# EAGLE schematic schemat sterownika Czujników (EAGLE 9.6.2)
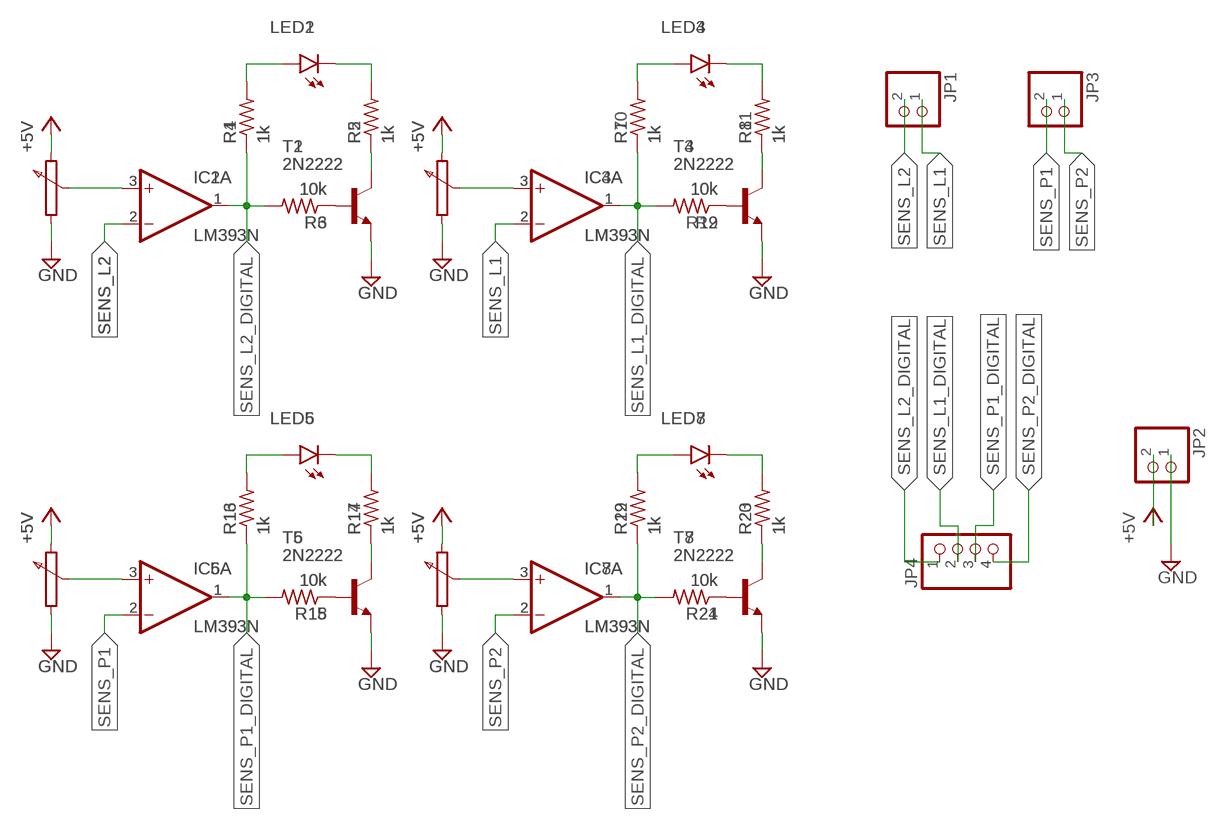
[diagram p0: schematic, sheet 1]

## Parts
IC1  LM393N  [DIL08]
IC2  LM393N  [DIL08]
IC3  LM393N  [DIL08]
IC4  LM393N  [DIL08]
IC5  LM393N  [DIL08]
IC6  LM393N  [DIL08]
IC7  LM393N  [DIL08]
IC8  LM393N  [DIL08]
JP1  PINHD-1X2  [1X02]
JP2  PINHD-1X2  [1X02]
JP3  PINHD-1X2  [1X02]
JP4  PINHD-1X4  [1X04]
LED1  LED3MM  [LED3MM]
LED2  LED3MM  [LED3MM]
LED3  LED3MM  [LED3MM]
LED4  LED3MM  [LED3MM]
LED5  LED3MM  [LED3MM]
LED6  LED3MM  [LED3MM]
LED7  LED3MM  [LED3MM]
LED8  LED3MM  [LED3MM]
R1  1k  R-US_R0603  [R0603]
R2  1k  R-US_R0603  [R0603]
R3  10k  R-US_R0603  [R0603]
R4  1k  R-US_R0603  [R0603]
R5  1k  R-US_R0603  [R0603]
R6  10k  R-US_R0603  [R0603]
R7  1k  R-US_R0603  [R0603]
R8  1k  R-US_R0603  [R0603]
R9  10k  R-US_R0603  [R0603]
R10  1k  R-US_R0603  [R0603]
R11  1k  R-US_R0603  [R0603]
R12  10k  R-US_R0603  [R0603]
R13  1k  R-US_R0603  [R0603]
R14  1k  R-US_R0603  [R0603]
R15  10k  R-US_R0603  [R0603]
R16  1k  R-US_R0603  [R0603]
R17  1k  R-US_R0603  [R0603]
R18  10k  R-US_R0603  [R0603]
R19  1k  R-US_R0603  [R0603]
R20  1k  R-US_R0603  [R0603]
R21  10k  R-US_R0603  [R0603]
R22  1k  R-US_R0603  [R0603]
R23  1k  R-US_R0603  [R0603]
R24  10k  R-US_R0603  [R0603]
T1  2N2222  [TO18]
T2  2N2222  [TO18]
T3  2N2222  [TO18]
T4  2N2222  [TO18]
T5  2N2222  [TO18]
T6  2N2222  [TO18]
T7  2N2222  [TO18]
T8  2N2222  [TO18]

## Nets
+5V: JP2.2
GND: JP2.1 T1.1(E) T2.1(E) T3.1(E) T4.1(E) T5.1(E) T6.1(E) T7.1(E) T8.1(E)
N$1: LED1.A R1.2
N$2: LED1.K(C) R2.2
N$3: R2.1 T1.3(C)
N$4: R3.1 T1.2(B)
N$5: IC1.1(A:OUT) R1.1 R3.2
N$6: IC1.3(A:+IN)
N$7: IC1.2(A:-IN)
N$8: LED2.A R4.2
N$9: LED2.K(C) R5.2
N$10: R5.1 T2.3(C)
N$11: R6.1 T2.2(B)
N$12: JP4.1
N$13: IC2.3(A:+IN)
N$14: IC2.2(A:-IN)
N$15: LED3.A R7.2
N$16: LED3.K(C) R8.2
N$17: R8.1 T3.3(C)
N$18: R9.1 T3.2(B)
N$19: IC3.1(A:OUT) R7.1 R9.2
N$20: IC3.3(A:+IN)
N$21: IC3.2(A:-IN)
N$22: LED4.A R10.2
N$23: LED4.K(C) R11.2
N$24: R11.1 T4.3(C)
N$25: R12.1 T4.2(B)
N$26: JP4.2
N$27: IC4.3(A:+IN)
N$28: IC4.2(A:-IN)
N$29: LED5.A R13.2
N$30: LED5.K(C) R14.2
N$31: R14.1 T5.3(C)
N$32: R15.1 T5.2(B)
N$33: IC5.1(A:OUT) IC6.1(A:OUT) R13.1 R15.2 R16.1 R18.2
N$34: IC5.3(A:+IN)
N$35: IC5.2(A:-IN)
N$36: LED6.A R16.2
N$37: LED6.K(C) R17.2
N$38: R17.1 T6.3(C)
N$39: R18.1 T6.2(B)
N$40: JP4.3
N$41: IC6.3(A:+IN)
N$42: IC6.2(A:-IN)
N$43: LED7.A R19.2
N$44: LED7.K(C) R20.2
N$45: R20.1 T7.3(C)
N$46: R21.1 T7.2(B)
N$47: IC7.1(A:OUT) R19.1 R21.2
N$48: IC7.3(A:+IN)
N$49: IC7.2(A:-IN)
N$50: LED8.A R22.2
N$51: LED8.K(C) R23.2
N$52: R23.1 T8.3(C)
N$53: R24.1 T8.2(B)
N$54: JP4.4
N$55: IC8.3(A:+IN)
N$56: IC8.2(A:-IN)
SENS_L1: JP1.1
SENS_L1_DIGITAL: IC4.1(A:OUT) R10.1 R12.2
SENS_L2: JP1.2
SENS_L2_DIGITAL: IC2.1(A:OUT) R4.1 R6.2
SENS_P1: JP3.2
SENS_P2: JP3.1
SENS_P2_DIGITAL: IC8.1(A:OUT) R22.1 R24.2
Unconnected: IC1.5(B:+IN) IC1.6(B:-IN) IC1.7(B:OUT) IC2.5(B:+IN) IC2.6(B:-IN) IC2.7(B:OUT) IC3.5(B:+IN) IC3.6(B:-IN) IC3.7(B:OUT) IC4.5(B:+IN) IC4.6(B:-IN) IC4.7(B:OUT) IC5.5(B:+IN) IC5.6(B:-IN) IC5.7(B:OUT) IC6.5(B:+IN) IC6.6(B:-IN) IC6.7(B:OUT) IC7.5(B:+IN) IC7.6(B:-IN) IC7.7(B:OUT) IC8.5(B:+IN) IC8.6(B:-IN) IC8.7(B:OUT)

## Power pins joined to a net without a drawn wire
V+: IC1.8(P:V+) IC2.8(P:V+) IC3.8(P:V+) IC4.8(P:V+) IC5.8(P:V+) IC6.8(P:V+) IC7.8(P:V+) IC8.8(P:V+)
V-: IC1.4(P:V-) IC2.4(P:V-) IC3.4(P:V-) IC4.4(P:V-) IC5.4(P:V-) IC6.4(P:V-) IC7.4(P:V-) IC8.4(P:V-)

## Library data of the parts
IC1-IC8 = linear:LM393: COMPARATOR
JP1-JP3 = pinhead:PINHD-1X2: PIN HEADER
JP4 = pinhead:PINHD-1X4: PIN HEADER
LED1-LED8 = led:LED: LED OSRAM: - CHIPLED LG R971, LG N971, LY N971, LG Q971, LY Q971, LO R971, LY R971 LH N974, LH R974 LS Q976, LO Q976, LY Q976 LO Q996 - Hyper CHIPLED LW Q18S LB Q993, LB Q99A, LB R99A - SideLED LS A670, LO A670, LY A670, LG A670, LP A670 LB A673, LV A673, LT A673, LW A673 LH A674 LY A675 LS A676, LA A676, LO A676, LY A676, LW A676 LS A679, LY A679, LG A679 - Hyper Micro SIDELED® LS Y876, LA Y876, LO Y876, LY Y876 LT Y87S - SmartLED LW L88C, LW L88S LB L89C, LB L89S, LG L890 LS L89K, LO L89K, LY L89K LS L896, LA L896, LO L896, LY L896 - TOPLED LS T670, LO T670, LY T670, LG T670, LP T670 LSG T670, LSP T670, LSY T670, LOP T670, LYG T670 LG T671, LOG T671, LSG T671 LB T673, LV T673, LT T673, LW T673 LH T674 LS T676, LA T676, LO T676, LY T676, LB T676, LH T676, LSB T676, LW T676 LB T67C, LV T67C, LT T67C, LS T67K, LO T67K, LY T67K, LW E67C LS E67B, LA E67B, LO E67B, LY E67B, LB E67C, LV E67C, LT E67C LW T67C LS T679, LY T679, LG T679 LS T770, LO T770, LY T770, LG T770, LP T770 LB T773, LV T773, LT T773, LW T773 LH T774 LS E675, LA E675, LY E675, LS T675 LS T776, LA T776, LO T776, LY T776, LB T776 LHGB T686 LT T68C, LB T68C - Hyper Mini TOPLED® LB M676 - Mini TOPLED Santana® LG M470 LS M47K, LO M47K, LY M47K Source: http://www.osram.convergy.de LUXEON: - LUMILED® LXK2-PW12-R00, LXK2-PW12-S00, LXK2-PW14-U00, LXK2-PW14-V00 LXK2-PM12-R00, LXK2-PM12-S00, LXK2-PM14-U00 LXK2-PE12-Q00, LXK2-PE12-R00, LXK2-PE12-S00, LXK2-PE14-T00, LXK2-PE14-U00 LXK2-PB12-K00, LXK2-PB12-L00, LXK2-PB12-M00, LXK2-PB14-N00, LXK2-PB14-P00, LXK2-PB14-Q00 LXK2-PR12-L00, LXK2-PR12-M00, LXK2-PR14-Q00, LXK2-PR14-R00 LXK2-PD12-Q00, LXK2-PD12-R00, LXK2-PD12-S00 LXK2-PH12-R00, LXK2-PH12-S00 LXK2-PL12-P00, LXK2-PL12-Q00, LXK2-PL12-R00 Source: www.luxeon.com KINGBRIGHT: KA-3528ASYC Source: www.kingbright.com
R1-R24 = rcl:R-US_: RESISTOR, American symbol; SPICEPREFIX: R
T1-T8 = transistor:2N2222: NPN TRANSISTOR